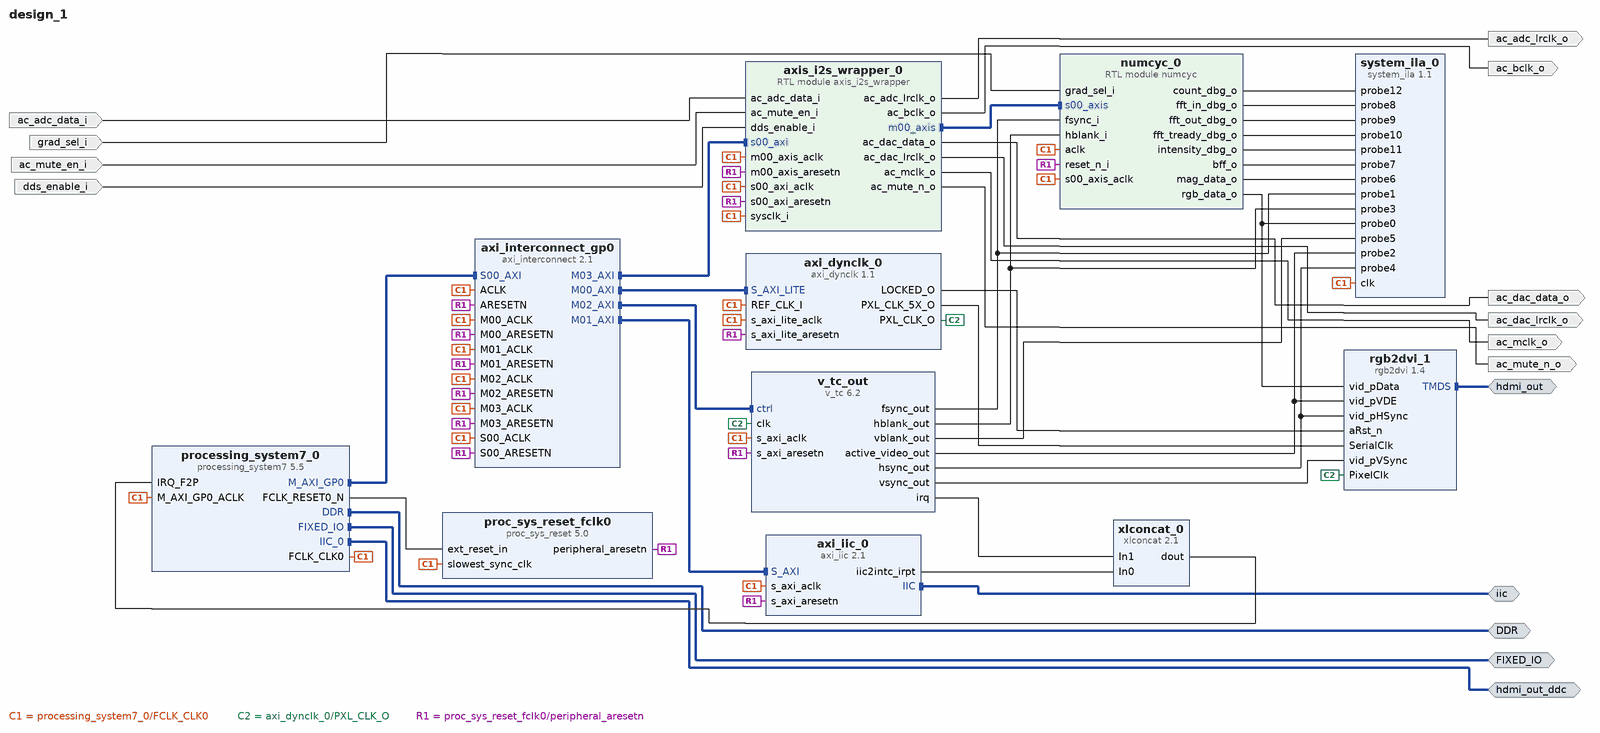
[diagram p0: block diagram of the top level]
# Vivado block design design_1, xc7z010clg400-1, Vivado 2021.2
create_bd_design design_1

create_bd_intf_port -mode Master -vlnv xilinx.com:interface:ddrx_rtl:1.0 DDR
create_bd_intf_port -mode Master -vlnv xilinx.com:display_processing_system7:fixedio_rtl:1.0 FIXED_IO
create_bd_intf_port -mode Master -vlnv digilentinc.com:interface:tmds_rtl:1.0 hdmi_out
create_bd_intf_port -mode Master -vlnv xilinx.com:interface:iic_rtl:1.0 hdmi_out_ddc
create_bd_intf_port -mode Master -vlnv xilinx.com:interface:iic_rtl:1.0 iic
create_bd_port -dir O ac_dac_lrclk_o
create_bd_port -dir O ac_mclk_o
create_bd_port -dir O ac_bclk_o
create_bd_port -dir O ac_dac_data_o
create_bd_port -dir O ac_mute_n_o
create_bd_port -dir O ac_adc_lrclk_o
create_bd_port -dir I ac_adc_data_i
create_bd_port -dir I ac_mute_en_i
create_bd_port -dir I grad_sel_i
create_bd_port -dir I dds_enable_i

create_bd_cell -type ip -vlnv digilentinc.com:ip:axi_dynclk:1.1 axi_dynclk_0
create_bd_cell -type ip -vlnv xilinx.com:ip:proc_sys_reset:5.0 proc_sys_reset_fclk0
create_bd_cell -type ip -vlnv xilinx.com:ip:processing_system7:5.5 processing_system7_0
set_property -dict [list \
  CONFIG.PCW_APU_PERIPHERAL_FREQMHZ 667 \
  CONFIG.PCW_ENET0_ENET0_IO {MIO 16 .. 27} \
  CONFIG.PCW_ENET0_GRP_MDIO_ENABLE 1 \
  CONFIG.PCW_ENET0_GRP_MDIO_IO {MIO 52 .. 53} \
  CONFIG.PCW_ENET0_PERIPHERAL_ENABLE 1 \
  CONFIG.PCW_ENET0_RESET_ENABLE 0 \
  CONFIG.PCW_ENET_RESET_ENABLE 1 \
  CONFIG.PCW_ENET_RESET_SELECT {Share reset pin} \
  CONFIG.PCW_FCLK1_PERIPHERAL_CLKSRC {DDR PLL} \
  CONFIG.PCW_FPGA0_PERIPHERAL_FREQMHZ 100 \
  CONFIG.PCW_FPGA1_PERIPHERAL_FREQMHZ 134 \
  CONFIG.PCW_FPGA2_PERIPHERAL_FREQMHZ 200 \
  CONFIG.PCW_GPIO_MIO_GPIO_ENABLE 1 \
  CONFIG.PCW_GPIO_MIO_GPIO_IO MIO \
  CONFIG.PCW_I2C0_I2C0_IO EMIO \
  CONFIG.PCW_I2C0_PERIPHERAL_ENABLE 1 \
  CONFIG.PCW_I2C_PERIPHERAL_FREQMHZ 111.111115 \
  CONFIG.PCW_I2C_RESET_ENABLE 1 \
  CONFIG.PCW_I2C_RESET_SELECT {Share reset pin} \
  CONFIG.PCW_IRQ_F2P_INTR 1 \
  CONFIG.PCW_PRESET_BANK1_VOLTAGE {LVCMOS 1.8V} \
  CONFIG.PCW_QSPI_GRP_FBCLK_ENABLE 1 \
  CONFIG.PCW_QSPI_GRP_FBCLK_IO {MIO 8} \
  CONFIG.PCW_QSPI_GRP_SINGLE_SS_ENABLE 1 \
  CONFIG.PCW_QSPI_GRP_SINGLE_SS_IO {MIO 1 .. 6} \
  CONFIG.PCW_QSPI_PERIPHERAL_ENABLE 1 \
  CONFIG.PCW_QSPI_QSPI_IO {MIO 1 .. 6} \
  CONFIG.PCW_SD0_GRP_CD_ENABLE 1 \
  CONFIG.PCW_SD0_GRP_CD_IO {MIO 47} \
  CONFIG.PCW_SD0_GRP_WP_ENABLE 0 \
  CONFIG.PCW_SD0_PERIPHERAL_ENABLE 1 \
  CONFIG.PCW_SD0_SD0_IO {MIO 40 .. 45} \
  CONFIG.PCW_SDIO_PERIPHERAL_FREQMHZ 50 \
  CONFIG.PCW_SINGLE_QSPI_DATA_MODE x4 \
  CONFIG.PCW_UART1_PERIPHERAL_ENABLE 1 \
  CONFIG.PCW_UART1_UART1_IO {MIO 48 .. 49} \
  CONFIG.PCW_UART_PERIPHERAL_FREQMHZ 100 \
  CONFIG.PCW_UIPARAM_DDR_FREQ_MHZ 533.333333 \
  CONFIG.PCW_UIPARAM_DDR_MEMORY_TYPE {DDR 3 (Low Voltage)} \
  CONFIG.PCW_UIPARAM_DDR_PARTNO {MT41K256M16 RE-125} \
  CONFIG.PCW_USB0_PERIPHERAL_ENABLE 1 \
  CONFIG.PCW_USB0_RESET_ENABLE 1 \
  CONFIG.PCW_USB0_RESET_IO {MIO 46} \
  CONFIG.PCW_USB0_USB0_IO {MIO 28 .. 39} \
  CONFIG.PCW_USB_RESET_ENABLE 1 \
  CONFIG.PCW_USB_RESET_SELECT {Share reset pin} \
  CONFIG.PCW_USE_FABRIC_INTERRUPT 1 \
] [get_bd_cells processing_system7_0]
# 301 more settings of processing_system7_0 are not shown: defaults, MIO pin electricals, DDR timing, and values the tool derives
create_bd_cell -type ip -vlnv digilentinc.com:ip:rgb2dvi:1.4 rgb2dvi_1
set_property -dict [list \
  CONFIG.TMDS_BOARD_INTERFACE hdmi_out \
  CONFIG.kGenerateSerialClk false \
  CONFIG.kRstActiveHigh false \
] [get_bd_cells rgb2dvi_1]
create_bd_cell -type ip -vlnv xilinx.com:ip:axi_interconnect:2.1 axi_interconnect_gp0
set_property -dict {CONFIG.NUM_MI 4} [get_bd_cells axi_interconnect_gp0]
create_bd_cell -type ip -vlnv xilinx.com:ip:v_tc:6.2 v_tc_out
set_property -dict {CONFIG.enable_detection false} [get_bd_cells v_tc_out]
create_bd_cell -type ip -vlnv xilinx.com:ip:system_ila:1.1 system_ila_0
set_property -dict [list \
  CONFIG.C_MON_TYPE NATIVE \
  CONFIG.C_NUM_OF_PROBES 13 \
  CONFIG.C_SLOT_0_INTF_TYPE xilinx.com:interface:video_timing_rtl:2.0 \
] [get_bd_cells system_ila_0]
create_bd_cell -type ip -vlnv xilinx.com:ip:axi_iic:2.1 axi_iic_0
set_property -dict {CONFIG.IIC_BOARD_INTERFACE Custom CONFIG.USE_BOARD_FLOW true} [get_bd_cells axi_iic_0]
create_bd_cell -type ip -vlnv xilinx.com:ip:xlconcat:2.1 xlconcat_0
create_bd_cell -type module -reference numcyc numcyc_0
create_bd_cell -type module -reference axis_i2s_wrapper axis_i2s_wrapper_0

# ---- connections ----

connect_bd_intf_net [get_bd_intf_pins axi_interconnect_gp0/S00_AXI] [get_bd_intf_pins processing_system7_0/M_AXI_GP0]
connect_bd_intf_net [get_bd_intf_ports iic] [get_bd_intf_pins axi_iic_0/IIC]
connect_bd_intf_net [get_bd_intf_pins axi_interconnect_gp0/M00_AXI] [get_bd_intf_pins axi_dynclk_0/S_AXI_LITE]
connect_bd_intf_net [get_bd_intf_pins axi_interconnect_gp0/M01_AXI] [get_bd_intf_pins axi_iic_0/S_AXI]
connect_bd_intf_net [get_bd_intf_pins axi_interconnect_gp0/M02_AXI] [get_bd_intf_pins v_tc_out/ctrl]
connect_bd_intf_net [get_bd_intf_pins axi_interconnect_gp0/M03_AXI] [get_bd_intf_pins axis_i2s_wrapper_0/s00_axi]
connect_bd_intf_net [get_bd_intf_pins axis_i2s_wrapper_0/m00_axis] [get_bd_intf_pins numcyc_0/s00_axis]
connect_bd_intf_net [get_bd_intf_ports DDR] [get_bd_intf_pins processing_system7_0/DDR]
connect_bd_intf_net [get_bd_intf_ports FIXED_IO] [get_bd_intf_pins processing_system7_0/FIXED_IO]
connect_bd_intf_net [get_bd_intf_ports hdmi_out_ddc] [get_bd_intf_pins processing_system7_0/IIC_0]
connect_bd_intf_net [get_bd_intf_ports hdmi_out] [get_bd_intf_pins rgb2dvi_1/TMDS]
connect_bd_net -net ACLK_2 [get_bd_pins processing_system7_0/FCLK_CLK0] \
  [get_bd_pins axi_dynclk_0/REF_CLK_I] [get_bd_pins axi_dynclk_0/s_axi_lite_aclk] \
  [get_bd_pins proc_sys_reset_fclk0/slowest_sync_clk] [get_bd_pins processing_system7_0/M_AXI_GP0_ACLK] \
  [get_bd_pins axi_interconnect_gp0/ACLK] [get_bd_pins axi_interconnect_gp0/S00_ACLK] \
  [get_bd_pins axi_interconnect_gp0/M00_ACLK] [get_bd_pins axi_interconnect_gp0/M01_ACLK] [get_bd_pins v_tc_out/s_axi_aclk] \
  [get_bd_pins system_ila_0/clk] [get_bd_pins axi_interconnect_gp0/M02_ACLK] [get_bd_pins axi_iic_0/s_axi_aclk] \
  [get_bd_pins axi_interconnect_gp0/M03_ACLK] [get_bd_pins numcyc_0/aclk] [get_bd_pins numcyc_0/s00_axis_aclk] \
  [get_bd_pins axis_i2s_wrapper_0/sysclk_i] [get_bd_pins axis_i2s_wrapper_0/m00_axis_aclk] \
  [get_bd_pins axis_i2s_wrapper_0/s00_axi_aclk]
connect_bd_net [get_bd_ports ac_adc_data_i] [get_bd_pins axis_i2s_wrapper_0/ac_adc_data_i]
connect_bd_net [get_bd_ports ac_mute_en_i] [get_bd_pins axis_i2s_wrapper_0/ac_mute_en_i]
connect_bd_net [get_bd_pins axi_dynclk_0/LOCKED_O] [get_bd_pins rgb2dvi_1/aRst_n]
connect_bd_net [get_bd_pins axi_dynclk_0/PXL_CLK_5X_O] [get_bd_pins rgb2dvi_1/SerialClk]
connect_bd_net [get_bd_pins axi_dynclk_0/PXL_CLK_O] [get_bd_pins rgb2dvi_1/PixelClk] [get_bd_pins v_tc_out/clk]
connect_bd_net [get_bd_pins axi_iic_0/iic2intc_irpt] [get_bd_pins xlconcat_0/In0]
connect_bd_net [get_bd_pins axis_i2s_wrapper_0/ac_adc_lrclk_o] [get_bd_ports ac_adc_lrclk_o]
connect_bd_net [get_bd_pins axis_i2s_wrapper_0/ac_bclk_o] [get_bd_ports ac_bclk_o]
connect_bd_net [get_bd_pins axis_i2s_wrapper_0/ac_dac_data_o] [get_bd_ports ac_dac_data_o]
connect_bd_net [get_bd_pins axis_i2s_wrapper_0/ac_dac_lrclk_o] [get_bd_ports ac_dac_lrclk_o]
connect_bd_net [get_bd_pins axis_i2s_wrapper_0/ac_mclk_o] [get_bd_ports ac_mclk_o]
connect_bd_net [get_bd_pins axis_i2s_wrapper_0/ac_mute_n_o] [get_bd_ports ac_mute_n_o]
connect_bd_net [get_bd_ports dds_enable_i] [get_bd_pins axis_i2s_wrapper_0/dds_enable_i]
connect_bd_net [get_bd_ports grad_sel_i] [get_bd_pins numcyc_0/grad_sel_i]
connect_bd_net -net numcyc_0_dbg_r_mag_o [get_bd_pins numcyc_0/count_dbg_o] [get_bd_pins system_ila_0/probe12]
connect_bd_net [get_bd_pins numcyc_0/fft_in_dbg_o] [get_bd_pins system_ila_0/probe8]
connect_bd_net [get_bd_pins numcyc_0/fft_out_dbg_o] [get_bd_pins system_ila_0/probe9]
connect_bd_net [get_bd_pins numcyc_0/fft_tready_dbg_o] [get_bd_pins system_ila_0/probe10]
connect_bd_net [get_bd_pins numcyc_0/intensity_dbg_o] [get_bd_pins system_ila_0/probe11]
connect_bd_net -net numcyc_0_mag_data_o [get_bd_pins numcyc_0/bff_o] [get_bd_pins system_ila_0/probe7]
connect_bd_net [get_bd_pins numcyc_0/mag_data_o] [get_bd_pins system_ila_0/probe6]
connect_bd_net [get_bd_pins numcyc_0/rgb_data_o] [get_bd_pins rgb2dvi_1/vid_pData] [get_bd_pins system_ila_0/probe0]
connect_bd_net [get_bd_pins proc_sys_reset_fclk0/peripheral_aresetn] \
  [get_bd_pins axi_dynclk_0/s_axi_lite_aresetn] [get_bd_pins axi_interconnect_gp0/S00_ARESETN] \
  [get_bd_pins axi_interconnect_gp0/M00_ARESETN] [get_bd_pins axi_interconnect_gp0/M01_ARESETN] \
  [get_bd_pins v_tc_out/s_axi_aresetn] [get_bd_pins axi_interconnect_gp0/M02_ARESETN] \
  [get_bd_pins axi_interconnect_gp0/ARESETN] [get_bd_pins axi_iic_0/s_axi_aresetn] \
  [get_bd_pins axi_interconnect_gp0/M03_ARESETN] [get_bd_pins numcyc_0/reset_n_i] \
  [get_bd_pins axis_i2s_wrapper_0/m00_axis_aresetn] [get_bd_pins axis_i2s_wrapper_0/s00_axi_aresetn]
connect_bd_net [get_bd_pins processing_system7_0/FCLK_RESET0_N] [get_bd_pins proc_sys_reset_fclk0/ext_reset_in]
connect_bd_net [get_bd_pins v_tc_out/active_video_out] [get_bd_pins rgb2dvi_1/vid_pVDE] [get_bd_pins system_ila_0/probe2]
connect_bd_net [get_bd_pins v_tc_out/fsync_out] [get_bd_pins system_ila_0/probe1] [get_bd_pins numcyc_0/fsync_i]
connect_bd_net [get_bd_pins v_tc_out/hblank_out] [get_bd_pins system_ila_0/probe3] [get_bd_pins numcyc_0/hblank_i]
connect_bd_net [get_bd_pins v_tc_out/hsync_out] [get_bd_pins rgb2dvi_1/vid_pHSync] [get_bd_pins system_ila_0/probe4]
connect_bd_net [get_bd_pins v_tc_out/irq] [get_bd_pins xlconcat_0/In1]
connect_bd_net [get_bd_pins v_tc_out/vblank_out] [get_bd_pins system_ila_0/probe5]
connect_bd_net [get_bd_pins v_tc_out/vsync_out] [get_bd_pins rgb2dvi_1/vid_pVSync]
connect_bd_net [get_bd_pins xlconcat_0/dout] [get_bd_pins processing_system7_0/IRQ_F2P]

# ---- address map ----
assign_bd_address -offset 0x41600000 -range 64K -target_address_space [get_bd_addr_spaces processing_system7_0/Data] [get_bd_addr_segs axi_iic_0/S_AXI/Reg]
assign_bd_address -offset 0x43C00000 -range 64K -target_address_space [get_bd_addr_spaces processing_system7_0/Data] [get_bd_addr_segs axi_dynclk_0/S_AXI_LITE/S_AXI_LITE_reg]
assign_bd_address -offset 0x43C10000 -range 64K -target_address_space [get_bd_addr_spaces processing_system7_0/Data] [get_bd_addr_segs v_tc_out/ctrl/Reg]
assign_bd_address -offset 0x43C20000 -range 64K -target_address_space [get_bd_addr_spaces processing_system7_0/Data] [get_bd_addr_segs axis_i2s_wrapper_0/s00_axi/reg0]

validate_bd_design
save_bd_design
